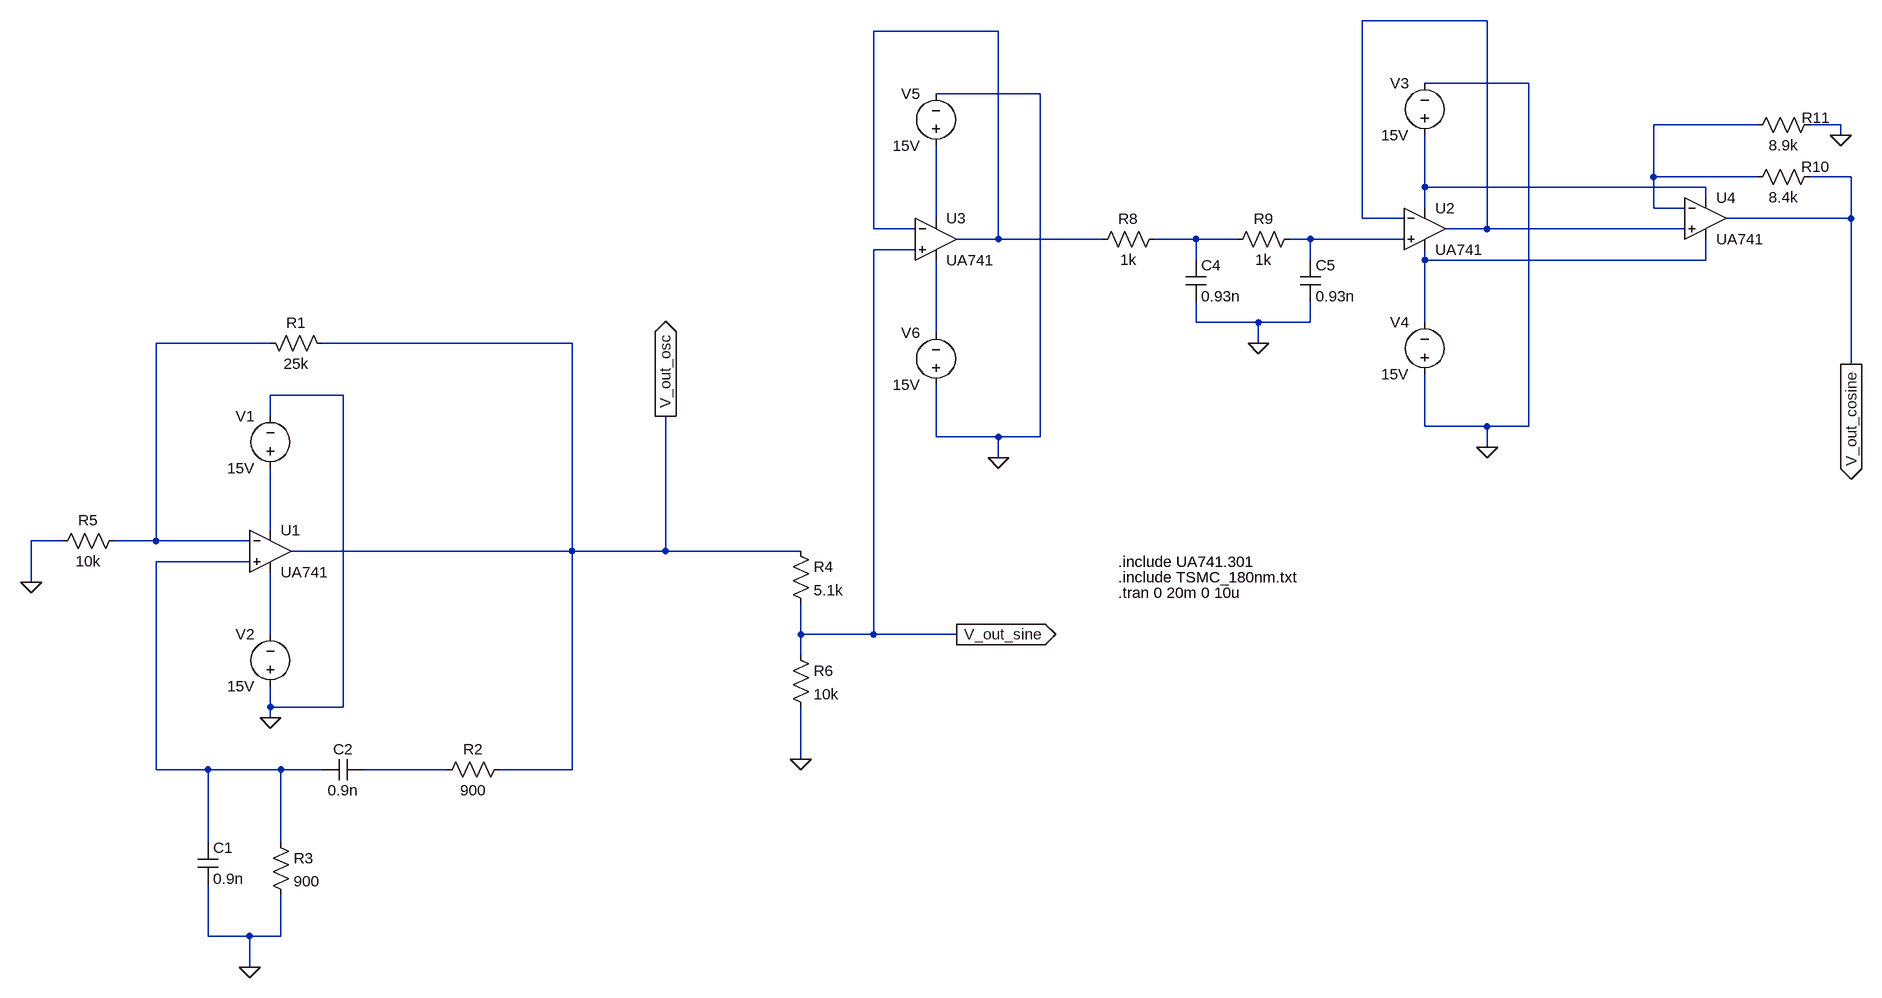
[diagram p0: schematic quadrature-oscillator.asc]
quadrature-oscillator.asc, the LTspice schematic file:
Version 4.1
SHEET 1 2264 1396
WIRE 1568 -352 1376 -352
WIRE 816 -336 624 -336
WIRE 1632 -256 1472 -256
WIRE 880 -240 720 -240
WIRE 1984 -192 1824 -192
WIRE 2112 -192 2064 -192
WIRE 2112 -176 2112 -192
WIRE 1824 -112 1824 -192
WIRE 1984 -112 1824 -112
WIRE 2128 -112 2064 -112
WIRE 1472 -96 1472 -176
WIRE 1904 -96 1472 -96
WIRE 1904 -80 1904 -96
WIRE 1472 -64 1472 -96
WIRE 1824 -64 1824 -112
WIRE 1872 -64 1824 -64
WIRE 720 -48 720 -160
WIRE 1376 -48 1376 -352
WIRE 1440 -48 1376 -48
WIRE 2128 -48 2128 -112
WIRE 2128 -48 1936 -48
WIRE 624 -32 624 -336
WIRE 688 -32 624 -32
WIRE 1568 -32 1568 -352
WIRE 1568 -32 1504 -32
WIRE 1872 -32 1568 -32
WIRE 816 -16 816 -336
WIRE 816 -16 752 -16
WIRE 976 -16 816 -16
WIRE 1120 -16 1056 -16
WIRE 1184 -16 1120 -16
WIRE 1296 -16 1264 -16
WIRE 1440 -16 1296 -16
WIRE 688 0 624 0
WIRE 1120 16 1120 -16
WIRE 1296 16 1296 -16
WIRE 1472 16 1472 0
WIRE 1904 16 1904 -16
WIRE 1904 16 1472 16
WIRE 1120 112 1120 80
WIRE 1216 112 1120 112
WIRE 1296 112 1296 80
WIRE 1296 112 1216 112
WIRE 1472 112 1472 16
WIRE 720 128 720 16
WIRE -304 144 -480 144
WIRE 160 144 -224 144
WIRE 1216 144 1216 112
WIRE 2128 176 2128 -48
WIRE -192 224 -304 224
WIRE -304 256 -304 224
WIRE 1472 272 1472 192
WIRE 1568 272 1472 272
WIRE 1632 272 1632 -256
WIRE 1632 272 1568 272
WIRE 720 288 720 208
WIRE 816 288 720 288
WIRE 880 288 880 -240
WIRE 880 288 816 288
WIRE 1568 304 1568 272
WIRE 816 320 816 288
WIRE -304 432 -304 336
WIRE -624 448 -672 448
WIRE -480 448 -480 144
WIRE -480 448 -544 448
WIRE -336 448 -480 448
WIRE 160 464 160 144
WIRE 160 464 -272 464
WIRE 304 464 304 256
WIRE 304 464 160 464
WIRE 512 464 304 464
WIRE -336 480 -480 480
WIRE -672 512 -672 448
WIRE -304 592 -304 496
WIRE 512 592 512 544
WIRE 624 592 624 0
WIRE 624 592 512 592
WIRE 752 592 624 592
WIRE 512 624 512 592
WIRE -304 704 -304 672
WIRE -192 704 -192 224
WIRE -192 704 -304 704
WIRE -304 720 -304 704
WIRE 512 784 512 704
WIRE -480 800 -480 480
WIRE -400 800 -480 800
WIRE -288 800 -400 800
WIRE -224 800 -288 800
WIRE -32 800 -160 800
WIRE 160 800 160 464
WIRE 160 800 48 800
WIRE -400 912 -400 800
WIRE -288 912 -288 800
WIRE -400 1056 -400 976
WIRE -336 1056 -400 1056
WIRE -288 1056 -288 992
WIRE -288 1056 -336 1056
WIRE -336 1104 -336 1056
FLAG 816 320 0
FLAG 1568 304 0
FLAG 1216 144 0
FLAG 2112 -176 0
FLAG 2128 176 V_out_cosine
IOPIN 2128 176 Out
FLAG -304 720 0
FLAG 512 784 0
FLAG 752 592 V_out_sine
IOPIN 752 592 Out
FLAG -336 1104 0
FLAG 304 256 V_out_osc
IOPIN 304 256 Out
FLAG -672 512 0
SYMBOL res -528 432 R90
WINDOW 0 0 56 VBottom 2
WINDOW 3 32 56 VTop 2
SYMATTR InstName R5
SYMATTR Value 10k
SYMBOL OpAmps\\opamp2 720 -80 R0
SYMATTR InstName U3
SYMATTR Value UA741
SYMBOL voltage 720 -144 R180
WINDOW 0 24 96 Left 2
WINDOW 3 24 16 Left 2
SYMATTR InstName V5
SYMATTR Value 15V
SYMBOL voltage 720 224 R180
WINDOW 0 24 96 Left 2
WINDOW 3 24 16 Left 2
SYMATTR InstName V6
SYMATTR Value 15V
SYMBOL res 1072 -32 R90
WINDOW 0 0 56 VBottom 2
WINDOW 3 32 56 VTop 2
SYMATTR InstName R8
SYMATTR Value 1k
SYMBOL res 1280 -32 R90
WINDOW 0 0 56 VBottom 2
WINDOW 3 32 56 VTop 2
SYMATTR InstName R9
SYMATTR Value 1k
SYMBOL voltage 1472 -160 R180
WINDOW 0 24 96 Left 2
WINDOW 3 24 16 Left 2
SYMATTR InstName V3
SYMATTR Value 15V
SYMBOL voltage 1472 208 R180
WINDOW 0 24 96 Left 2
WINDOW 3 24 16 Left 2
SYMATTR InstName V4
SYMATTR Value 15V
SYMBOL OpAmps\\opamp2 1904 -112 R0
SYMATTR InstName U4
SYMATTR Value UA741
SYMBOL OpAmps\\opamp2 1472 -96 R0
SYMATTR InstName U2
SYMATTR Value UA741
SYMBOL cap 1104 16 R0
SYMATTR InstName C4
SYMATTR Value 0.93n
SYMBOL cap 1280 16 R0
SYMATTR InstName C5
SYMATTR Value 0.93n
SYMBOL res 2080 -128 R90
WINDOW 0 16 7 VBottom 2
WINDOW 3 32 56 VTop 2
SYMATTR InstName R10
SYMATTR Value 8.4k
SYMBOL res 2080 -208 R90
WINDOW 0 21 6 VBottom 2
WINDOW 3 32 56 VTop 2
SYMATTR InstName R11
SYMATTR Value 8.9k
SYMBOL OpAmps\\opamp2 -304 400 R0
SYMATTR InstName U1
SYMATTR Value UA741
SYMBOL voltage -304 352 R180
WINDOW 0 24 96 Left 2
WINDOW 3 24 16 Left 2
SYMATTR InstName V1
SYMATTR Value 15V
SYMBOL res -320 128 M90
WINDOW 0 0 56 VBottom 2
WINDOW 3 32 56 VTop 2
SYMATTR InstName R1
SYMATTR Value 25k
SYMBOL res 64 784 R90
WINDOW 0 0 56 VBottom 2
WINDOW 3 32 56 VTop 2
SYMATTR InstName R2
SYMATTR Value 900
SYMBOL cap -416 912 R0
SYMATTR InstName C1
SYMATTR Value 0.9n
SYMBOL res -304 896 R0
SYMATTR InstName R3
SYMATTR Value 900
SYMBOL cap -160 784 R90
WINDOW 0 0 32 VBottom 2
WINDOW 3 32 32 VTop 2
SYMATTR InstName C2
SYMATTR Value 0.9n
SYMBOL voltage -304 688 R180
WINDOW 0 24 96 Left 2
WINDOW 3 24 16 Left 2
SYMATTR InstName V2
SYMATTR Value 15V
SYMBOL res 496 448 R0
SYMATTR InstName R4
SYMATTR Value 5.1k
SYMBOL res 496 608 R0
SYMATTR InstName R6
SYMATTR Value 10k
TEXT 1000 480 Left 2 !.include UA741.301
TEXT 1000 504 Left 2 !.include TSMC_180nm.txt
TEXT 1000 528 Left 2 !.tran 0 20m 0 10u

The netlist it stands for:
* quadrature-oscillator.asc
R5 N010 0 10k
X§U3 V_out_sine N002 N005 N009 N002 UA741  ; pins In+ In- V+ V- OUT
V5 N005 0 15V
V6 0 N009 15V
R8 N006 N002 1k
R9 N007 N006 1k
V3 N004 0 15V
V4 0 N008 15V
X§U4 N001 N003 N004 N008 V_out_cosine UA741  ; pins In+ In- V+ V- OUT
X§U2 N007 N001 N004 N008 N001 UA741  ; pins In+ In- V+ V- OUT
C4 N006 0 0.93n
C5 N007 0 0.93n
R10 V_out_cosine N003 8.4k
R11 0 N003 8.9k
X§U1 N012 N010 N011 N013 V_out_osc UA741  ; pins In+ In- V+ V- OUT
V1 N011 0 15V
R1 N010 V_out_osc 25k
R2 V_out_osc N014 900
C1 N012 0 0.9n
R3 N012 0 900
C2 N014 N012 0.9n
V2 0 N013 15V
R4 V_out_osc V_out_sine 5.1k
R6 V_out_sine 0 10k
.include UA741.301
.include TSMC_180nm.txt
.tran 0 20m 0 10u
.backanno
.end